# EAGLE design rapidshark-forward-breakout-mk-1.1 (EAGLE 7.5.0)
AUTHOR: sean@yak.net
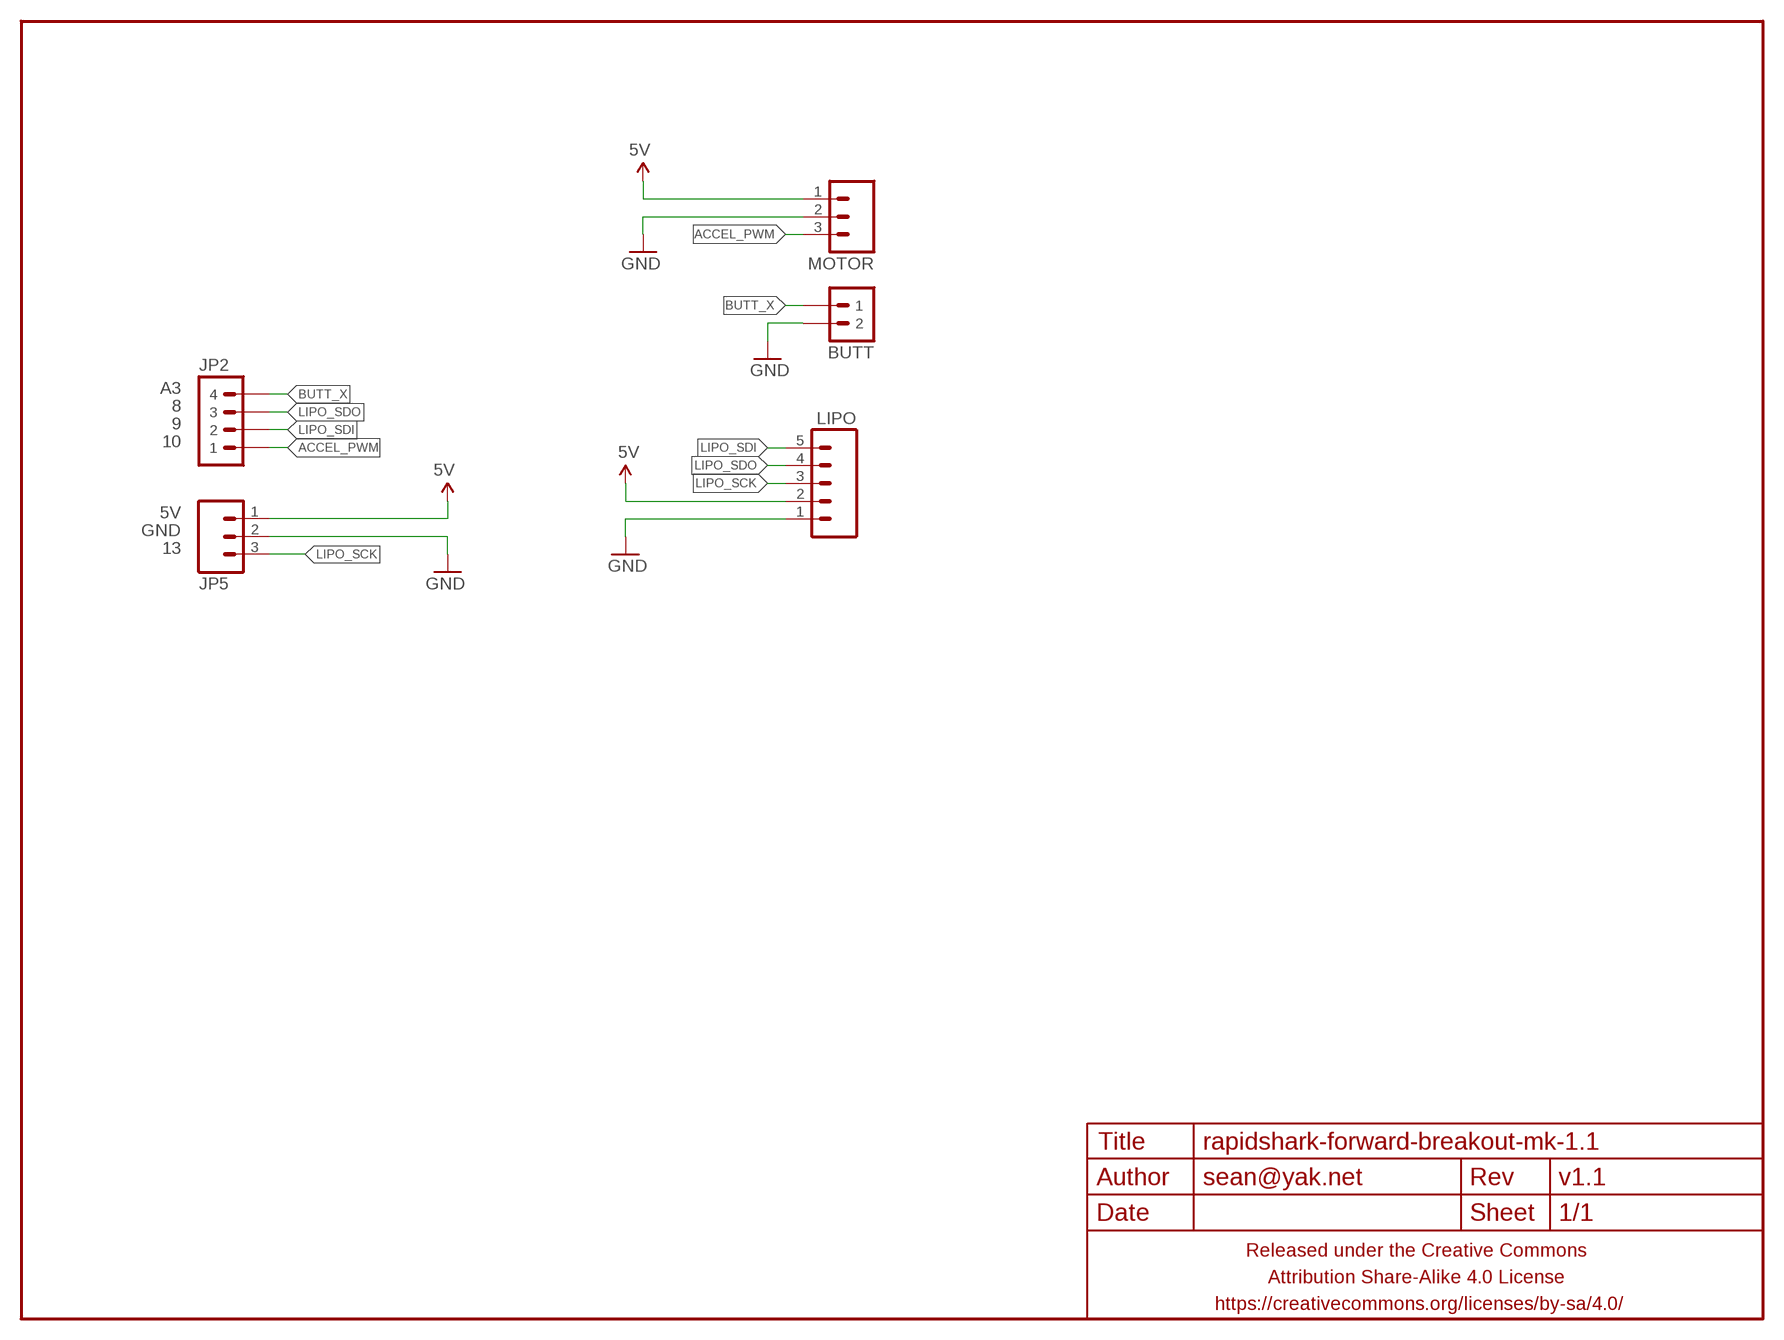
[diagram p0: schematic, sheet 1]

## Parts
BUTT  M02JST-PTH-VERT  [JST-2-PH-VERT-PTH]
FRAME1  FRAME-LETTERNO_PACKAGE  [DUMMY]
JP2  M04JST-PTH-VERT  [JST-4-PH-VERT-PTH]
JP5  M03JST-PTH-VERT  [JST-3-PH-VERT-PTH]
LIPO  M05JST-PH-VERT-PTH  [JST-5-PH-VERT-PTH]
MOTOR  M03JST-PTH-VERT  [JST-3-PH-VERT-PTH]

## Nets
5V: JP5.1 LIPO.2 MOTOR.1
ACCEL_PWM: JP2.1 MOTOR.3
BUTT_X: BUTT.1 JP2.4
GND: BUTT.2 JP5.2 LIPO.1 MOTOR.2
LIPO_SCK: JP5.3 LIPO.3
LIPO_SDI: JP2.2 LIPO.5
LIPO_SDO: JP2.3 LIPO.4

## Notes on the sheet
- A3
- 8
- 9
- 10
- 5V
- GND
- 13

## Library data of the parts
BUTT = a_parts:M02: Standard 2-pin 0.1" header. Use with - straight break away headers ( PRT-00116) - right angle break away headers (PRT-00553) - swiss pins (PRT-00743) - machine pins (PRT-00117) - female headers (PRT-00115) Molex polarized connector foot print use with: PRT-08233 with associated crimp pins and housings. 2.54_SCREWTERM for use with PRT-10571. 3.5mm Screw Terminal footprints for PRT-08084 5mm Screw Terminal footprints for use with PRT-08433
FRAME1 = a_parts:FRAME-LETTER: Schematic Frame Standard 8.5x11 US Letter frame; DESIGNER: sean@yak.net; VERSION: v1.1
JP2 = a_parts:M04: Header 4 Standard 4-pin 0.1" header. Use with straight break away headers (SKU : PRT-00116), right angle break away headers (PRT-00553), swiss pins (PRT-00743), machine pins (PRT-00117), and female headers (PRT-00115). Molex polarized connector foot print use with SKU : PRT-08231 with associated crimp pins and housings. 1MM SMD Version SKU: PRT-10208
JP5 MOTOR = a_parts:M03: Header 3 Standard 3-pin 0.1" header. Use with straight break away headers (SKU : PRT-00116), right angle break away headers (PRT-00553), swiss pins (PRT-00743), machine pins (PRT-00117), and female headers (PRT-00115). Molex polarized connector foot print use with SKU : PRT-08232 with associated crimp pins and housings.
LIPO = a_parts:M05: Header 5 Standard 5-pin 0.1" header. Use with straight break away headers (SKU : PRT-00116), right angle break away headers (PRT-00553), swiss pins (PRT-00743), machine pins (PRT-00117), and female headers (PRT-00115). Molex polarized connector foot print use with SKU : PRT-08230 with associated crimp pins and housings.

## Board
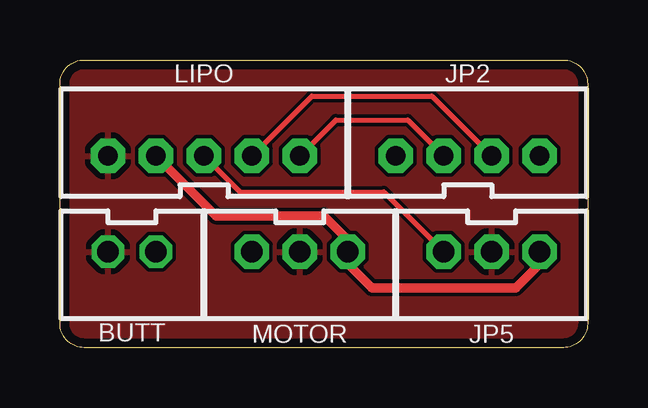
[diagram p1: board, top side]
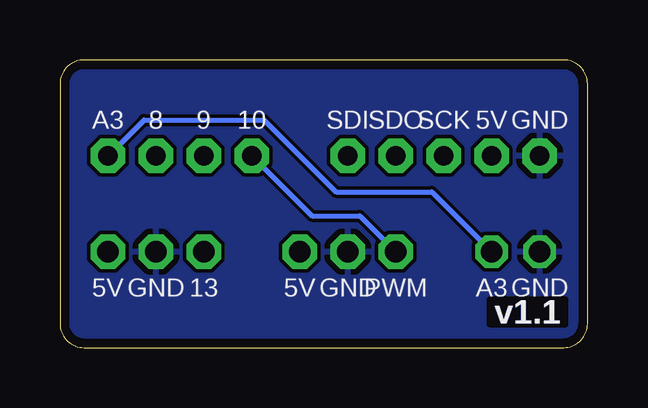
[diagram p2: board, bottom side, seen from below]

Size 22 x 12 mm. Coordinates in mm from the lower left corner, seen from the top.
Outline: 1,12 21,12 arc-90 22,11 22,1 arc-90 21,0 1,0 arc-90 0,1 0,11 arc-90 1,12
Copper layers (1*16): Top 0.0356mm / dielectric 1.5011mm / Bottom 0.0356mm
Design rules "LaenPCBOrder_2": minimum track width 6mil, minimum drill 13mil, track to track 6mil, track to pad 6mil, pad to pad 6mil, via to via 6mil, smd to smd 6mil, copper to edge 15mil, drill to drill 6mil, minimum pad ring 7mil, minimum via ring 7mil, stop-mask expansion 3mil, vias tented up to drill 20mil, thermal gap 10mil

### Footprints (pad centres in the part's own frame; a part is rotated, then mirrored left to right if it is on the bottom)
JST-2-PH-VERT-PTH = drill 0.9 octagon: 1 -1,0; 2 1,0
JST-4-PH-VERT-PTH = drill 0.8 pad 1.422 octagon: 1 0,0; 2 2,0; 3 4,0; 4 6,0
JST-3-PH-VERT-PTH = drill 0.9 pad 1.422 octagon: 1 0,0; 2 2,0; 3 4,0
JST-5-PH-VERT-PTH = drill 0.8 pad 1.422 octagon: 1 -4,0; 2 -2,0; 3 0,0; 4 2,0; 5 4,0

### Placement (x,y rotation side)
BUTT  3,4 180 top
FRAME1  0,0 270 bottom
JP2  14,8 0 top
JP5  20,4 180 top
LIPO  6,8 0 top
MOTOR  12,4 180 top

### Tracks (layer width: path | path; a pad name or v marks a point on that pad's centre or on a via)
5V
  Top 0.4: LIPO.2 6.5,5.5 11,5.5 12,4.5 MOTOR.1 12,3.5 13,2.5 19,2.5 20,3.5 JP5.1
ACCEL_PWM
  Bottom 0.2: JP2.1 11.5,5.5 9.5,5.5 MOTOR.3
BUTT_X
  Bottom 0.2: JP2.4 18.5,9.5 13.5,9.5 10.5,6.5 6.5,6.5 BUTT.1
GND
  pour Top (rank 6): 1,12 21,12 arc-90 22,11 22,1 arc-90 21,0 1,0 arc-90 0,1 0,11 arc-90
  pour Bottom (rank 6): 1,12 21,12 arc-90 22,11 22,1 arc-90 21,0 1,0 arc-90 0,1 0,11 arc-90
LIPO_SCK
  Top 0.2: LIPO.3 7.5,6.5 13.5,6.5 JP5.3
LIPO_SDI
  Top 0.2: LIPO.5 11.5,9.5 14.5,9.5 JP2.2
LIPO_SDO
  Top 0.2: LIPO.4 10.5,10.5 15.5,10.5 JP2.3

### Text on the board
bPlace: GND | 5V | SCK | SDO | SDI | 10 | 9 | 8 | A3 | GND | A3 | PWM | GND | 5V | 13 | GND | 5V